# EAGLE design key_diy_btm_wider (EAGLE 6.4)
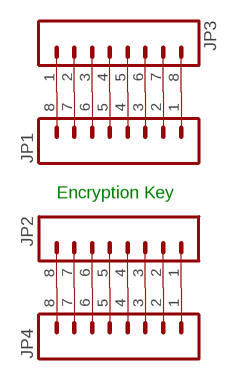
[diagram p0: schematic, sheet 1]

## Parts
JP1  M08LOCK  [1X08_LOCK]
JP2  M08LOCK  [1X08_LOCK]
JP3  M08LONGPADS  [1X08_LONGPADS]
JP4  M08LONGPADS  [1X08_LONGPADS]

## Nets
N$1: JP1.1 JP3.8
N$2: JP1.2 JP3.7
N$3: JP1.3 JP3.6
N$4: JP1.4 JP3.5
N$5: JP1.5 JP3.4
N$6: JP1.6 JP3.3
N$7: JP1.7 JP3.2
N$8: JP1.8 JP3.1
N$9: JP2.1 JP4.1
N$10: JP2.2 JP4.2
N$11: JP2.3 JP4.3
N$12: JP2.4 JP4.4
N$13: JP2.5 JP4.5
N$14: JP2.6 JP4.6
N$15: JP2.7 JP4.7
N$16: JP2.8 JP4.8

## Notes on the sheet
- Encryption Key

## Library data of the parts
JP1-JP4 = SparkFun-Connectors:M08: Header 8 Standard 8-pin 0.1" header. Use with straight break away headers (SKU : PRT-00116), right angle break away headers (PRT-00553), swiss pins (PRT-00743), machine pins (PRT-00117), and female headers (PRT-00115).

## Board
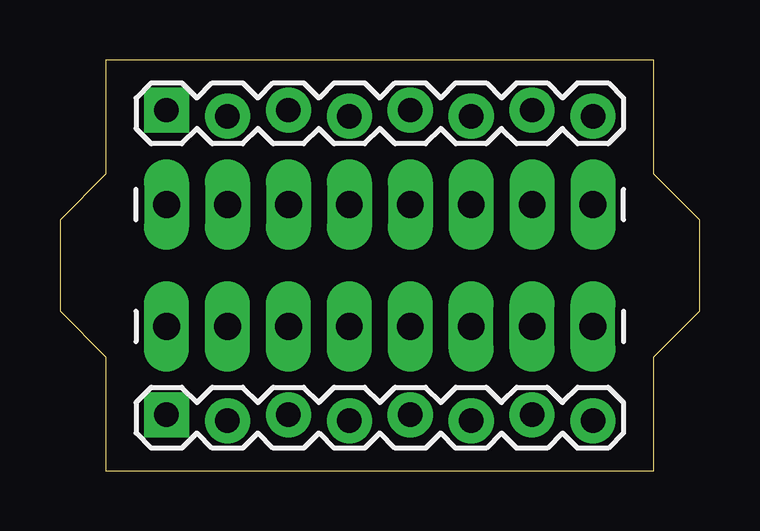
[diagram p1: board, top side]
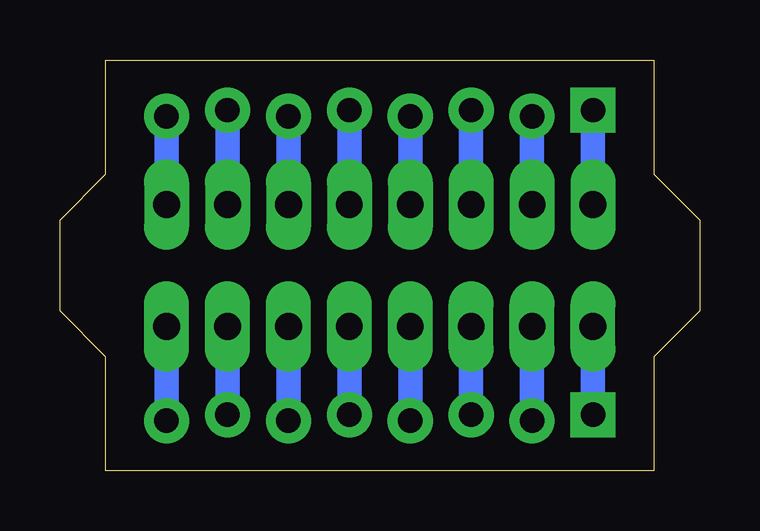
[diagram p2: board, bottom side, seen from below]

Size 26.67 x 17.14 mm. Coordinates in mm from the lower left corner, seen from the top.
Outline: 1.91,0 24.77,0 24.77,4.76 26.67,6.67 26.67,10.48 24.77,12.38 24.77,17.14 1.91,17.14 1.91,12.38 0,10.48 0,6.67 1.91,4.76 1.91,0
Copper layers (1*16): Top 0.035mm / dielectric 1.5mm / Bottom 0.035mm
Design rules "default": minimum track width 10mil, minimum drill 24mil, track to track 8mil, track to pad 8mil, pad to pad 8mil, via to via 8mil, smd to smd 8mil, copper to edge 40mil, drill to drill 8mil, minimum pad ring 10mil, minimum via ring 8mil, stop-mask expansion 4mil, vias tented up to drill 0mil, thermal gap 10mil

### Footprints (pad centres in the part's own frame; a part is rotated, then mirrored left to right if it is on the bottom)
1X08_LOCK = drill 1.016 pad 1.88 square: 1 0,0.127 | drill 1.016 pad 1.88: 2 2.54,-0.127; 3 5.08,0.127; 4 7.62,-0.127; 5 10.16,0.127; 6 12.7,-0.127; 7 15.24,0.127; 8 17.78,-0.127
1X08_LONGPADS = drill 1.118 pad 1.88 long: 1 0,0; 2 2.54,0; 3 5.08,0; 4 7.62,0; 5 10.16,0; 6 12.7,0; 7 15.24,0; 8 17.78,0

### Placement (x,y rotation side)
JP1  4.45,14.92 0 top
JP2  4.45,2.22 0 top
JP3  22.23,11.11 180 top
JP4  4.45,6.03 0 top

### Tracks (layer width: path | path; a pad name or v marks a point on that pad's centre or on a via)
N$1
  Bottom 1.016: JP1.1 JP3.8
N$2
  Bottom 1.016: JP3.7 JP1.2
N$3
  Bottom 1.016: JP1.3 JP3.6
N$4
  Bottom 1.016: JP1.4 JP3.5
N$5
  Bottom 1.016: JP1.5 JP3.4
N$6
  Bottom 1.016: JP1.6 JP3.3
N$7
  Bottom 1.016: JP1.7 JP3.2
N$8
  Bottom 1.016: JP1.8 JP3.1
N$9
  Bottom 1.016: JP2.1 JP4.1
N$10
  Bottom 1.016: JP4.2 JP2.2
N$11
  Bottom 1.016: JP4.3 JP2.3
N$12
  Bottom 1.016: JP4.4 JP2.4
N$13
  Bottom 1.016: JP4.5 JP2.5
N$14
  Bottom 1.016: JP2.6 JP4.6
N$15
  Bottom 1.016: JP4.7 JP2.7
N$16
  Bottom 1.016: JP4.8 JP2.8